# Altium schematic sheet S02.SchDoc: IEEE-1394/Ethernet FPGA Controller
size 381 x 254 mm; Revision: 3.2; SheetNumber: 2; SheetTotal: 10
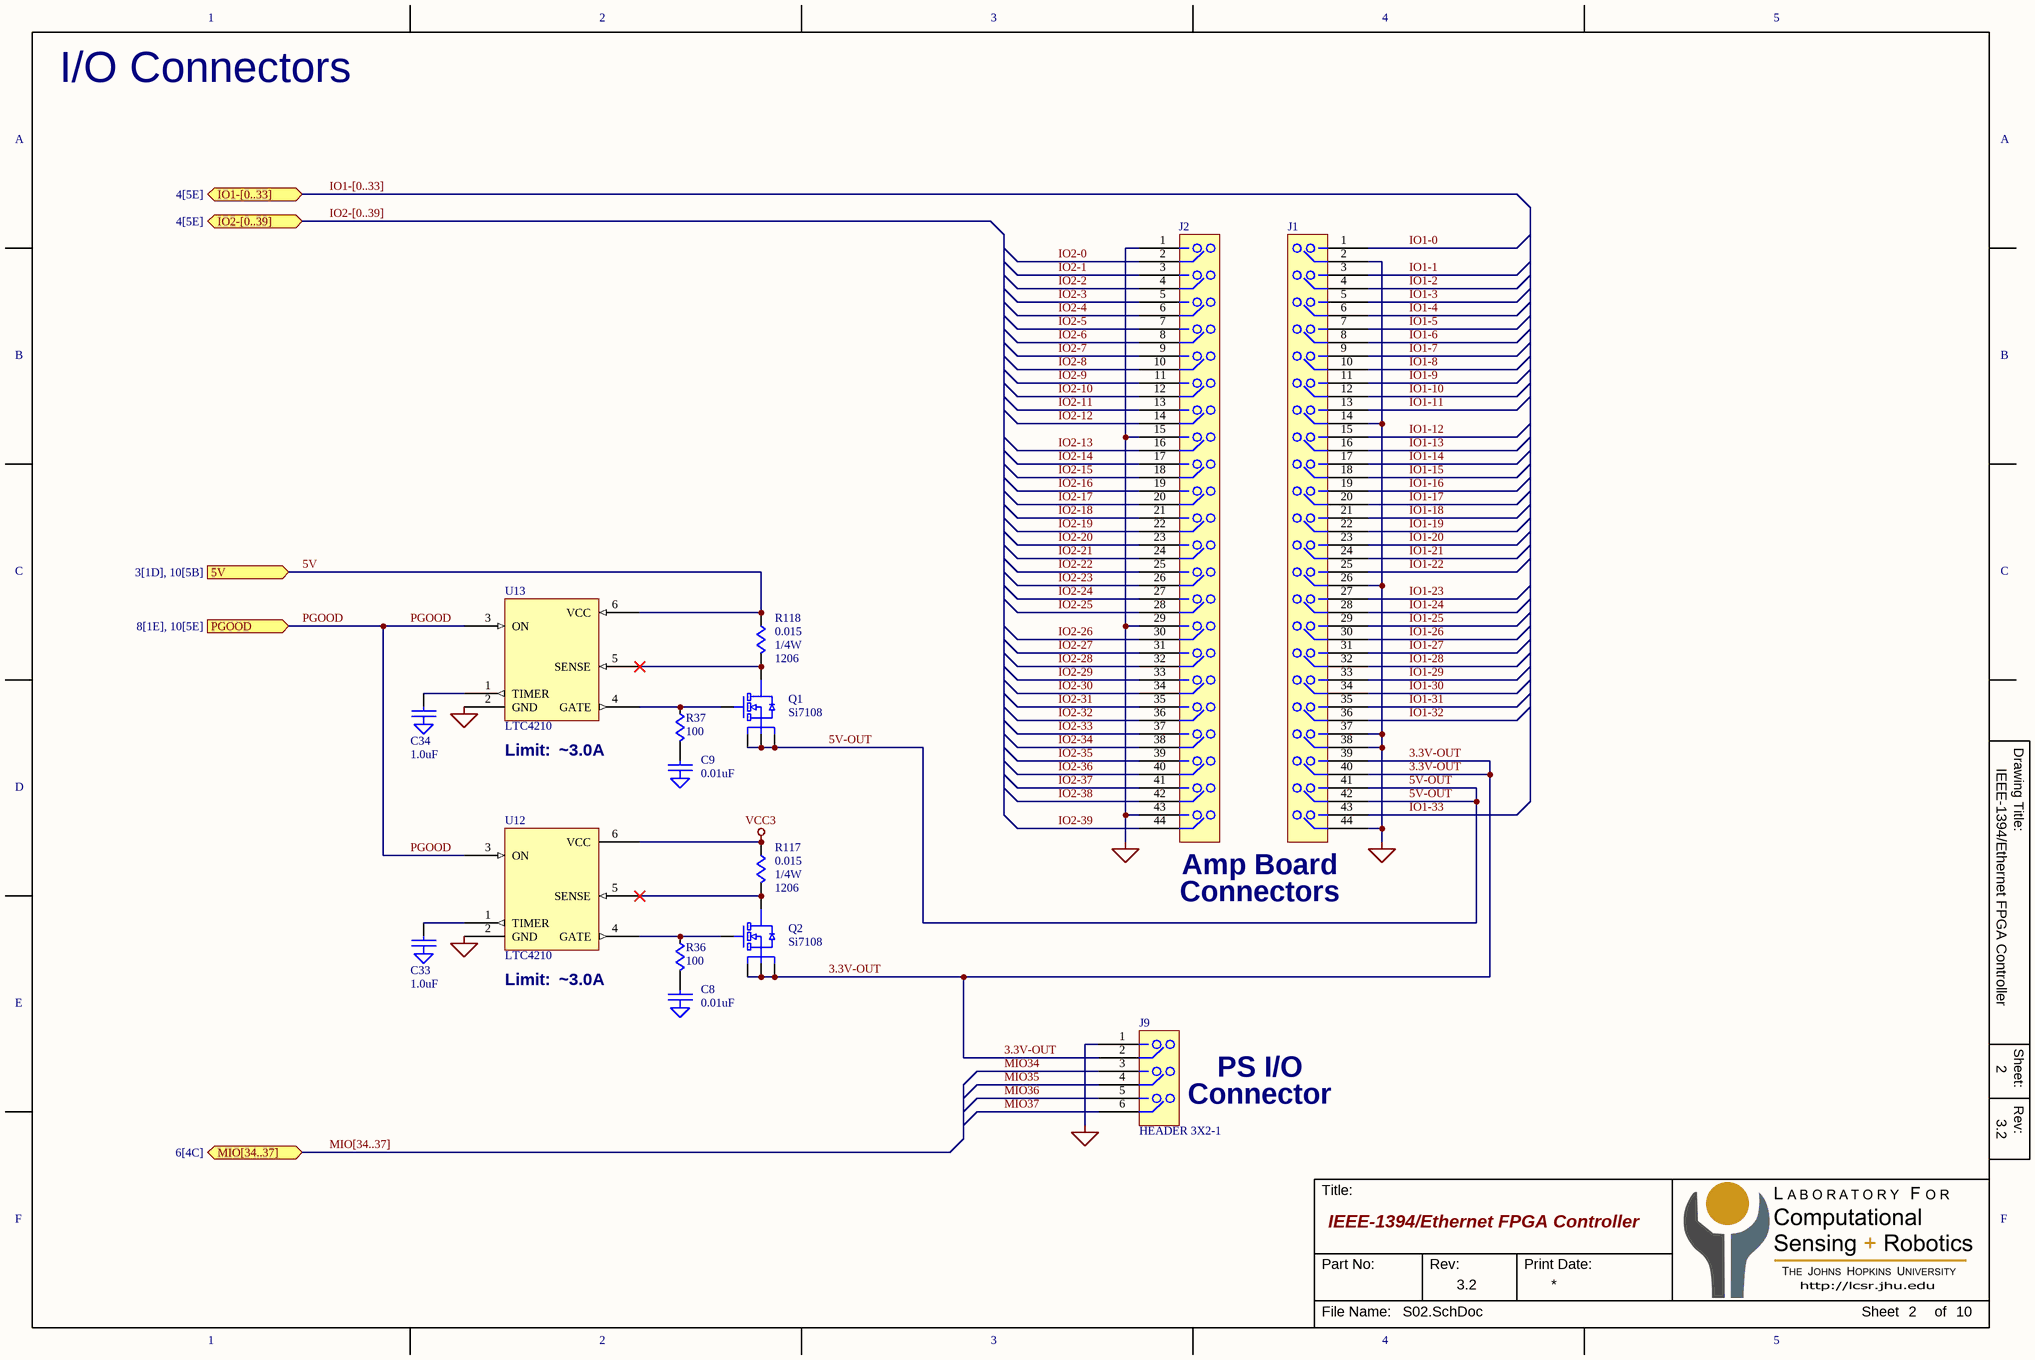
[diagram p0: S02.SchDoc]

## Parts
C8  0.01uF  [C0402]
C9  0.01uF  [C0402]
C33  1.0uF  [C0402]
C34  1.0uF  [C0402]
J1  HEADER 22x2-1  [HDR-22x2-2MM]  (value not drawn)
J2  HEADER 22x2-1  [HDR-22x2-2MM]  (value not drawn)
J9  HEADER 3X2-1  [HDR-3x2-2MM]
Q1  Si7108  [PowerPak-1212]
Q2  Si7108  [PowerPak-1212]
R36  100  [R0402]
R37  100  [R0402]
R117  0.015  Power: 1/4W  Type: 1206  [R1206]
R118  0.015  Power: 1/4W  Package: 1206  [R1206]
U12  LTC4210  [SOT-23-6]
U13  LTC4210  [SOT-23-6]

## Ports
5V (in, see 3[1D], 10[5B]), IO1-[0..33] (bidir, see 4[5E]), IO2-[0..39] (bidir, see 4[5E]), MIO[34..37] (bidir, see 6[4C]), PGOOD (in, see 8[1E], 10[5E])

## Nets
GND: C8.2(GND) C9.2(GND) C33.2(GND) C34.2(GND) J1.2 J1.14 J1.26 J1.37 J1.38 J1.44 J2.1 J2.15 J2.29 J2.43 J9.1 U12.2(GND) U13.2(GND)
VCC3: R117.1 U12.6(VCC)
3.3V-OUT: J1.39 J1.40 J9.2 Q2.1(S) Q2.2(S) Q2.3(S)
5V: R118.1 U13.6(VCC) ; port 5V
5V-OUT: J1.41 J1.42 Q1.1(S) Q1.2(S) Q1.3(S)
IO1-0: J1.1
IO1-1: J1.3
IO1-2: J1.4
IO1-3: J1.5
IO1-4: J1.6
IO1-5: J1.7
IO1-6: J1.8
IO1-7: J1.9
IO1-8: J1.10
IO1-9: J1.11
IO1-10: J1.12
IO1-11: J1.13
IO1-12: J1.15
IO1-13: J1.16
IO1-14: J1.17
IO1-15: J1.18
IO1-16: J1.19
IO1-17: J1.20
IO1-18: J1.21
IO1-19: J1.22
IO1-20: J1.23
IO1-21: J1.24
IO1-22: J1.25
IO1-23: J1.27
IO1-24: J1.28
IO1-25: J1.29
IO1-26: J1.30
IO1-27: J1.31
IO1-28: J1.32
IO1-29: J1.33
IO1-30: J1.34
IO1-31: J1.35
IO1-32: J1.36
IO1-33: J1.43
IO2-0: J2.2
IO2-1: J2.3
IO2-2: J2.4
IO2-3: J2.5
IO2-4: J2.6
IO2-5: J2.7
IO2-6: J2.8
IO2-7: J2.9
IO2-8: J2.10
IO2-9: J2.11
IO2-10: J2.12
IO2-11: J2.13
IO2-12: J2.14
IO2-13: J2.16
IO2-14: J2.17
IO2-15: J2.18
IO2-16: J2.19
IO2-17: J2.20
IO2-18: J2.21
IO2-19: J2.22
IO2-20: J2.23
IO2-21: J2.24
IO2-22: J2.25
IO2-23: J2.26
IO2-24: J2.27
IO2-25: J2.28
IO2-26: J2.30
IO2-27: J2.31
IO2-28: J2.32
IO2-29: J2.33
IO2-30: J2.34
IO2-31: J2.35
IO2-32: J2.36
IO2-33: J2.37
IO2-34: J2.38
IO2-35: J2.39
IO2-36: J2.40
IO2-37: J2.41
IO2-38: J2.42
IO2-39: J2.44
MIO34: J9.3
MIO35: J9.4
MIO36: J9.5
MIO37: J9.6
PGOOD: U12.3(ON) U13.3(ON) ; port PGOOD
NetC8_1: C8.1 R36.2
NetC9_1: C9.1 R37.2
NetC33_1: C33.1 U12.1(TIMER)
NetC34_1: C34.1 U13.1(TIMER)
NetQ1_4: Q1.4(G) R37.1 U13.4(GATE)
NetQ1_5: Q1.5(D) R118.2 U13.5(SENSE)
NetQ2_4: Q2.4(G) R36.1 U12.4(GATE)
NetQ2_5: Q2.5(D) R117.2 U12.5(SENSE)

## Buses and harness runs
bus IO1-[0..33] = port IO1-[0..33]
bus IO2-[0..39] = port IO2-[0..39]
bus MIO[34..37] = port MIO[34..37]

## Notes on the sheet
- I/O Connectors
- (near U13) Limit:
- (near U13) ~3.0A
- Amp Board
- Connectors
- (near U12) Limit:
- (near U12) ~3.0A
- PS I/O
- Connector
- 1
- 2
- 3
- 4
- 5
- A
- B
- C
- Drawing Title:
- D
- E
- Sheet:
- Rev:
- F
- Title:
- Part No:
- Print Date:
- File Name:
- Sheet
- of

## Library data of the parts
C8 C9 C33 C34 = CAP-GND
Q1 Q2 = MOSFET-N-PPACK
R36 R37 = R-MINI
R117 R118 = R